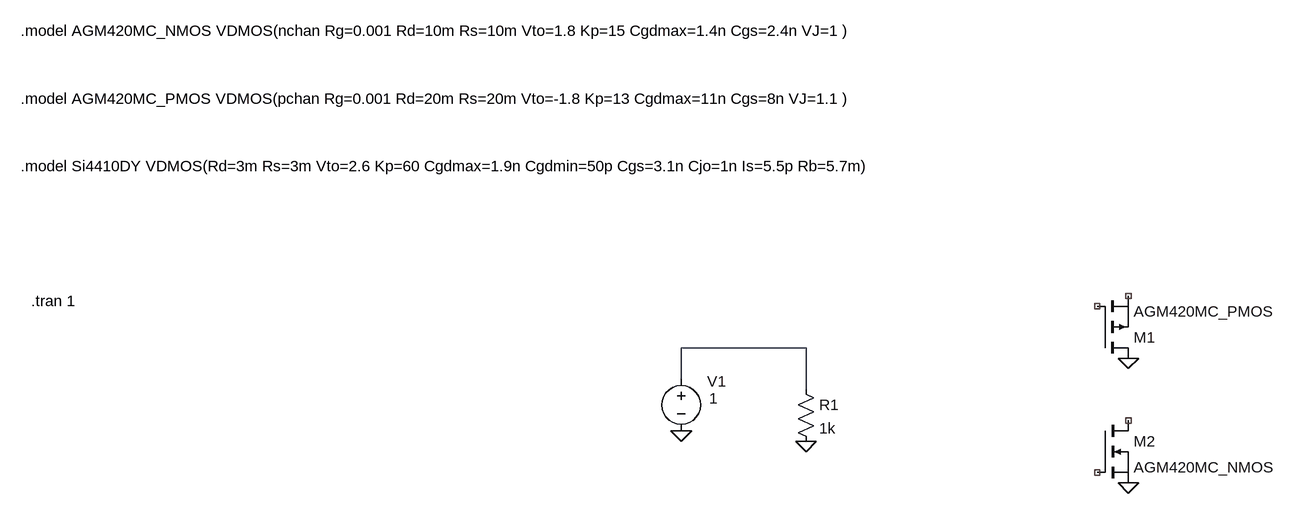
[diagram p0: schematic FET test.asc]
FET test.asc, the LTspice schematic file:
Version 4
SHEET 1 1940 680
WIRE 1216 448 1024 448
WIRE 1024 496 1024 448
WIRE 1216 512 1216 448
FLAG 1216 592 0
FLAG 1024 576 0
FLAG 1712 464 0
FLAG 1712 656 0
SYMBOL res 1200 496 R0
SYMATTR InstName R1
SYMATTR Value 1k
SYMBOL voltage 1024 480 R0
WINDOW 0 40 20 Left 2
WINDOW 3 43 46 Left 2
WINDOW 123 0 0 Left 0
SYMATTR InstName V1
SYMATTR Value 1
SYMATTR SpiceLine Rser=.001
SYMBOL pmos 1664 464 M180
SYMATTR InstName M1
SYMATTR Value AGM420MC_PMOS
SYMATTR SpiceModel AGM420MC_PMOS
SYMBOL nmos 1664 560 R0
SYMATTR InstName M2
SYMATTR Value AGM420MC_NMOS
SYMATTR SpiceModel AGM420MC_NMOS
TEXT 8 -40 Left 2 !.model AGM420MC_NMOS VDMOS(nchan Rg=0.001 Rd=10m Rs=10m Vto=1.8 Kp=15 Cgdmax=1.4n Cgs=2.4n VJ=1 )
TEXT 24 376 Left 2 !.tran 1
TEXT 8 168 Left 2 !.model Si4410DY VDMOS(Rd=3m Rs=3m Vto=2.6 Kp=60 Cgdmax=1.9n Cgdmin=50p Cgs=3.1n Cjo=1n Is=5.5p Rb=5.7m)
TEXT 8 64 Left 2 !.model AGM420MC_PMOS VDMOS(pchan Rg=0.001 Rd=20m Rs=20m Vto=-1.8 Kp=13 Cgdmax=11n Cgs=8n VJ=1.1 )

The netlist it stands for:
* FET test.asc
R1 N001 0 1k
V1 N001 0 1 Rser=.001
M1 0 NC_01 NC_02 NC_02 AGM420MC_PMOS AGM420MC_PMOS
M2 NC_03 NC_04 0 0 AGM420MC_NMOS AGM420MC_NMOS
.model NMOS NMOS
.model PMOS PMOS
.lib standard.mos
.model AGM420MC_NMOS VDMOS(nchan Rg=0.001 Rd=10m Rs=10m Vto=1.8 Kp=15 Cgdmax=1.4n Cgs=2.4n VJ=1 )
.tran 1
.model Si4410DY VDMOS(Rd=3m Rs=3m Vto=2.6 Kp=60 Cgdmax=1.9n Cgdmin=50p Cgs=3.1n Cjo=1n Is=5.5p Rb=5.7m)
.model AGM420MC_PMOS VDMOS(pchan Rg=0.001 Rd=20m Rs=20m Vto=-1.8 Kp=13 Cgdmax=11n Cgs=8n VJ=1.1 )
.backanno
.end